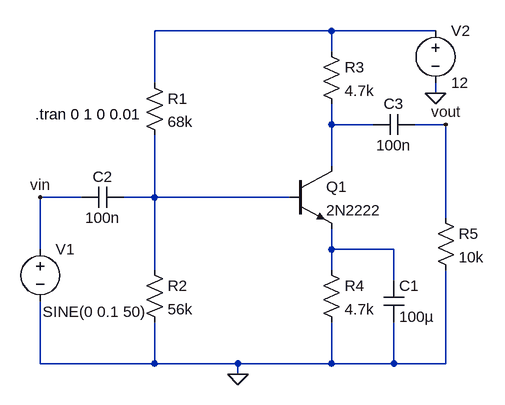
[diagram p0: schematic ceamp.asc]
ceamp.asc, the LTspice schematic file:
Version 4
SHEET 1 880 680
WIRE 256 -96 -16 -96
WIRE 416 -96 256 -96
WIRE 256 -64 256 -96
WIRE -16 -16 -16 -96
WIRE 416 0 416 -16
WIRE 256 48 256 16
WIRE 320 48 256 48
WIRE 432 48 384 48
WIRE 256 112 256 48
WIRE -128 160 -192 160
WIRE -16 160 -16 64
WIRE -16 160 -64 160
WIRE 192 160 -16 160
WIRE 432 192 432 48
WIRE -192 240 -192 160
WIRE 256 240 256 208
WIRE 352 240 256 240
WIRE -16 272 -16 160
WIRE 256 272 256 240
WIRE 352 288 352 240
WIRE -192 416 -192 320
WIRE -16 416 -16 352
WIRE -16 416 -192 416
WIRE 112 416 -16 416
WIRE 256 416 256 352
WIRE 256 416 112 416
WIRE 352 416 352 352
WIRE 352 416 256 416
WIRE 432 416 432 272
WIRE 432 416 352 416
WIRE 112 432 112 416
FLAG 416 0 0
FLAG 112 432 0
FLAG -192 160 vin
FLAG 432 48 vout
SYMBOL npn 192 112 R0
SYMATTR InstName Q1
SYMATTR Value 2N2222
SYMBOL res -32 -32 R0
SYMATTR InstName R1
SYMATTR Value 68k
SYMBOL res -32 256 R0
SYMATTR InstName R2
SYMATTR Value 56k
SYMBOL res 240 256 R0
SYMATTR InstName R4
SYMATTR Value 4.7k
SYMBOL cap -64 144 R90
WINDOW 0 0 32 VBottom 2
WINDOW 3 32 32 VTop 2
SYMATTR InstName C2
SYMATTR Value 100n
SYMBOL voltage -192 224 R0
WINDOW 123 0 0 Left 0
WINDOW 39 0 0 Left 0
WINDOW 3 4 112 Left 2
SYMATTR InstName V1
SYMATTR Value SINE(0 0.1 50)
SYMBOL voltage 416 -112 R0
WINDOW 123 0 0 Left 0
WINDOW 39 0 0 Left 0
SYMATTR InstName V2
SYMATTR Value 12
SYMBOL cap 336 288 R0
SYMATTR InstName C1
SYMATTR Value 100µ
SYMBOL res 240 -80 R0
SYMATTR InstName R3
SYMATTR Value 4.7k
SYMBOL res 416 176 R0
SYMATTR InstName R5
SYMATTR Value 10k
SYMBOL cap 384 32 R90
WINDOW 0 0 32 VBottom 2
WINDOW 3 32 32 VTop 2
SYMATTR InstName C3
SYMATTR Value 100n
TEXT -200 32 Left 2 !.tran 0 1 0 0.01

The netlist it stands for:
* ceamp.asc
Q1 N002 N003 N004 0 2N2222
R1 N001 N003 68k
R2 N003 0 56k
R4 N004 0 4.7k
C2 N003 vin 100n
V1 vin 0 SINE(0 0.1 50)
V2 N001 0 12
C1 N004 0 100µ
R3 N001 N002 4.7k
R5 vout 0 10k
C3 vout N002 100n
.model NPN NPN
.model PNP PNP
.lib standard.bjt
.tran 0 1 0 0.01
.backanno
.end